# Altium schematic sheet Memory.SchDoc
size A3
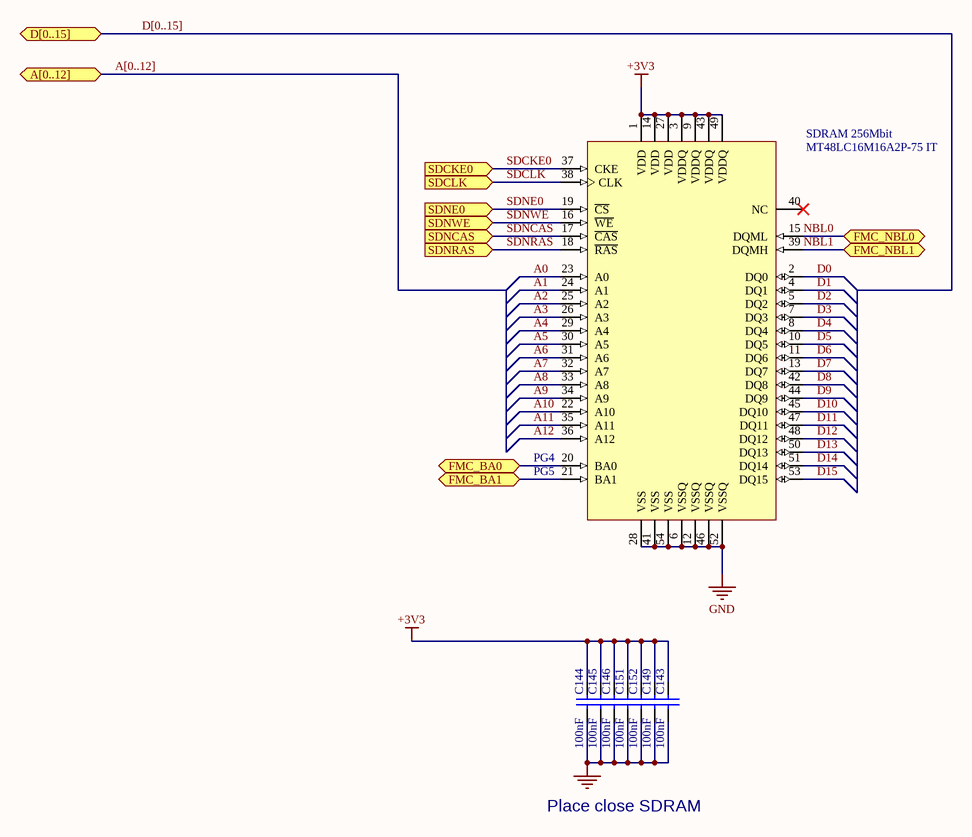
[diagram p0: Memory.SchDoc]

## Parts
C143  100nF  [0603_C]
C144  100nF  [0603_C]
C145  100nF  [0603_C]
C146  100nF  [0603_C]
C149  100nF  [0603_C]
C151  100nF  [0603_C]
C152  100nF  [0603_C]
SDRAM_256Mbit  MT48LC16M16A2P-75 IT  [TSOP2-54_N]

## Ports
A[0..12], D[0..15], FMC_BA0, FMC_BA1, FMC_NBL0, FMC_NBL1, SDCKE0 (in), SDCLK (in), SDNCAS (in), SDNE0 (in), SDNRAS (in), SDNWE (in)

## Nets
+3V3: C143.1 C144.1 C145.1 C146.1 C149.1 C151.1 C152.1 SDRAM_256Mbit.1(VDD) SDRAM_256Mbit.3(VDDQ) SDRAM_256Mbit.9(VDDQ) SDRAM_256Mbit.14(VDD) SDRAM_256Mbit.27(VDD) SDRAM_256Mbit.43(VDDQ) SDRAM_256Mbit.49(VDDQ)
GND: C143.2 C144.2 C145.2 C146.2 C149.2 C151.2 C152.2 SDRAM_256Mbit.6(VSSQ) SDRAM_256Mbit.12(VSSQ) SDRAM_256Mbit.28(VSS) SDRAM_256Mbit.41(VSS) SDRAM_256Mbit.46(VSSQ) SDRAM_256Mbit.52(VSSQ) SDRAM_256Mbit.54(VSS)
A0: SDRAM_256Mbit.23(A0)
A1: SDRAM_256Mbit.24(A1)
A2: SDRAM_256Mbit.25(A2)
A3: SDRAM_256Mbit.26(A3)
A4: SDRAM_256Mbit.29(A4)
A5: SDRAM_256Mbit.30(A5)
A6: SDRAM_256Mbit.31(A6)
A7: SDRAM_256Mbit.32(A7)
A8: SDRAM_256Mbit.33(A8)
A9: SDRAM_256Mbit.34(A9)
A10: SDRAM_256Mbit.22(A10)
A11: SDRAM_256Mbit.35(A11)
A12: SDRAM_256Mbit.36(A12)
D0: SDRAM_256Mbit.2(DQ0)
D1: SDRAM_256Mbit.4(DQ1)
D2: SDRAM_256Mbit.5(DQ2)
D3: SDRAM_256Mbit.7(DQ3)
D4: SDRAM_256Mbit.8(DQ4)
D5: SDRAM_256Mbit.10(DQ5)
D6: SDRAM_256Mbit.11(DQ6)
D7: SDRAM_256Mbit.13(DQ7)
D8: SDRAM_256Mbit.42(DQ8)
D9: SDRAM_256Mbit.44(DQ9)
D10: SDRAM_256Mbit.45(DQ10)
D11: SDRAM_256Mbit.47(DQ11)
D12: SDRAM_256Mbit.48(DQ12)
D13: SDRAM_256Mbit.50(DQ13)
D14: SDRAM_256Mbit.51(DQ14)
D15: SDRAM_256Mbit.53(DQ15)
FMC_BA0: SDRAM_256Mbit.20(BA0) ; port FMC_BA0
FMC_BA1: SDRAM_256Mbit.21(BA1) ; port FMC_BA1
NBL0: SDRAM_256Mbit.15(DQML) ; port FMC_NBL0
NBL1: SDRAM_256Mbit.39(DQMH) ; port FMC_NBL1
SDCKE0: SDRAM_256Mbit.37(CKE) ; port SDCKE0
SDCLK: SDRAM_256Mbit.38(CLK) ; port SDCLK
SDNCAS: SDRAM_256Mbit.17(~{CAS}) ; port SDNCAS
SDNE0: SDRAM_256Mbit.19(~{CS}) ; port SDNE0
SDNRAS: SDRAM_256Mbit.18(~{RAS}) ; port SDNRAS
SDNWE: SDRAM_256Mbit.16(~{WE}) ; port SDNWE

Not connected (* = marked no-connect by the designer): SDRAM_256Mbit 40(NC)*

## Buses and harness runs
bus A[0..12] = port A[0..12]
bus D[0..15] = port D[0..15]

## Notes on the sheet
- (near SDRAM_256Mbit) PG4
- (near SDRAM_256Mbit) PG5
- Place close SDRAM

## Library data of the parts
C143-C146 C149 C151 C152 = Cap: Capacitor; Value: 10nF; Published: 8-Jun-2000; Revision: July-2002: Re-released for DXP Platform.; Publisher: Altium Limited
SDRAM_256Mbit = MT48LC16M16A2P-75 IT: 256Mb Synchronous High-Speed CMOS DRAM, 16Mb x 16Bit x 4 Banks, 54-Pin TSOP Pb-free, Industrial; CycleTime: 7.5ns @ CL = 3 (PC133); RowAddress: 8K (A0-A12); ColumnAddress: 512 (A0-A8); Published: 11-Oct-2004; LatestRevisionDate: 13-Apr-2006; LatestRevisionNote: IPC-7351 Footprint Added.; DatasheetVersion: RevL, Oct-2007; PackageVersion: Sep-2003; PackageReference: TSOP2-54; Publisher: Altium Limited; PackageDescription: 54-Pin Plastic Small Outline Package 0.8 mm Pitch; Code_JEDEC: MS-024-FA; ComponentLink1Description: Manufacturer Link; ComponentLink1URL: http://www.micron.com; ComponentLink2Description: Datasheet; ComponentLink2URL: http://download.micron.com/pdf/datasheets/dram/sdram/256MSDRAM.pdf